# EAGLE design f1042-2 (EAGLE 7.6.0)
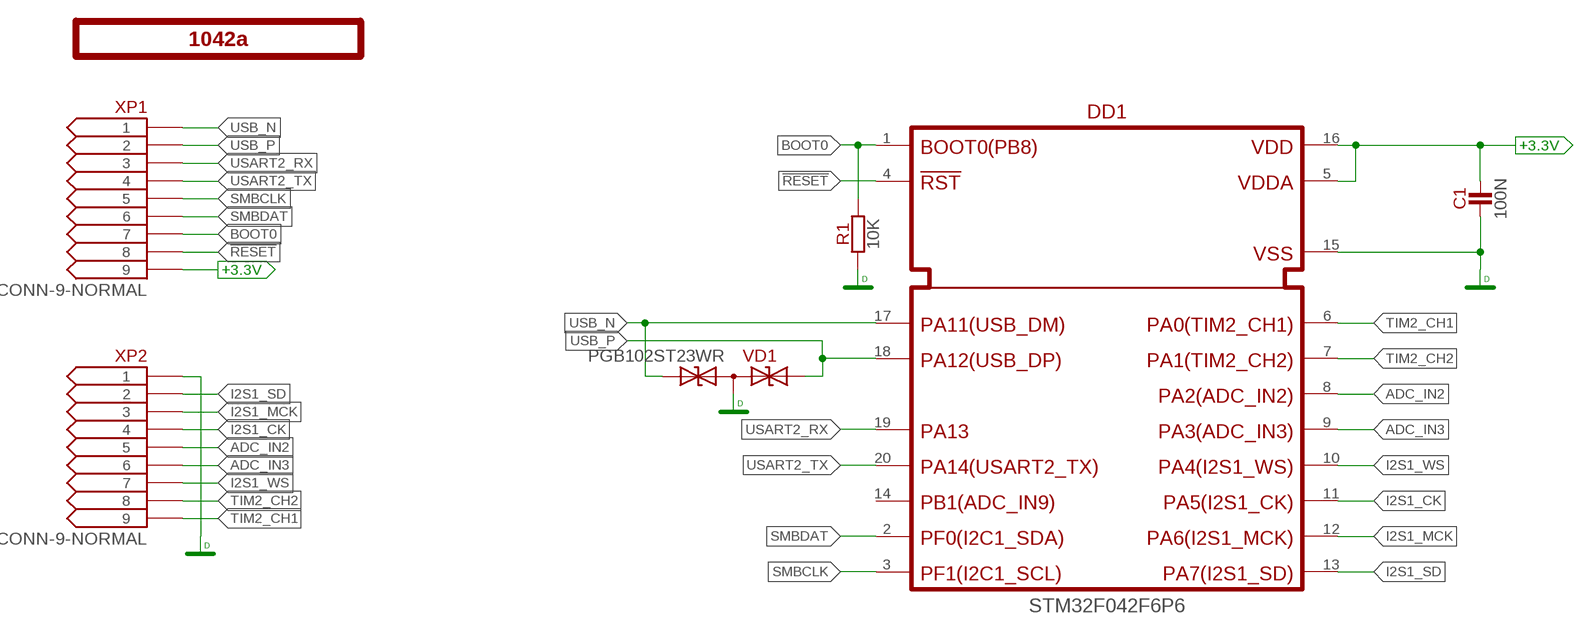
[diagram p0: schematic, sheet 1]

## Parts
C1  100N  [C-0805]
DD1  STM32F042F6P6  [TSSOP20]
PCB1  1042a  GENERIC-LOGO  [F-LOGO]
R1  10K  [R-0805]
VD1  PGB102ST23WR  [SOT23]
XP1  CONN-9-NORMAL  [MA03-9]
XP2  CONN-9-NORMAL  [MA03-9]

## Nets
!RESET: DD1.4(!RST) XP1.8
+3.3V: C1.2 DD1.5(VDDA) DD1.16(VDD) XP1.9
ADC_IN2: DD1.8(PA2) XP2.5
ADC_IN3: DD1.9(PA3) XP2.6
BOOT0: DD1.1(BOOT0) R1.2 XP1.7
DGND: C1.1 DD1.15(VSS) R1.1 VD1.3(C) XP2.1
I2S1_CK: DD1.11(PA5) XP2.4
I2S1_MCK: DD1.12(PA6) XP2.3
I2S1_SD: DD1.13(PA7) XP2.2
I2S1_WS: DD1.10(PA4) XP2.7
SMBCLK: DD1.3(PF1) XP1.5
SMBDAT: DD1.2(PF0) XP1.6
TIM2_CH1: DD1.6(PA0) XP2.9
TIM2_CH2: DD1.7(PA1) XP2.8
USART2_RX: DD1.19(PA13) XP1.3
USART2_TX: DD1.20(PA14) XP1.4
USB_N: DD1.17(PA11) VD1.2(A1) XP1.1
USB_P: DD1.18(PA12) VD1.1(A) XP1.2
Unconnected: DD1.14(PB1)

## Library data of the parts
C1 = capacitors:?; MOUSER: 77-VJ0805V104MXBPBC
DD1 = ic-stm:STM32F042F6P6; MOUSER: 511-STM32F042F6P6
PCB1 = module-footprints:GENERIC
R1 = resistors:?; MOUSER: 660-RK73H2ATTD1002F
VD1 = diodes-zener:PGB102ST23WR; MOUSER: 576-PGB102ST23WR
XP1 XP2 = connectors:CONN-9-?

## Board
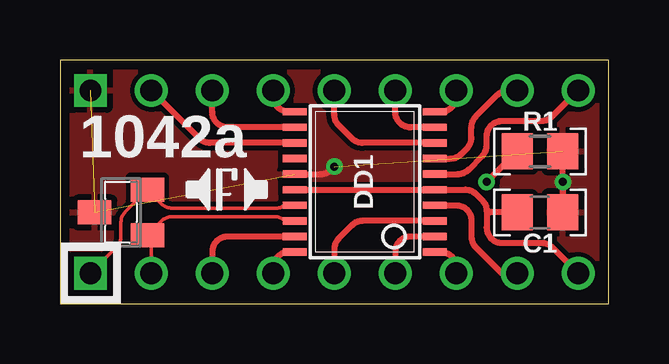
[diagram p1: board, top side]
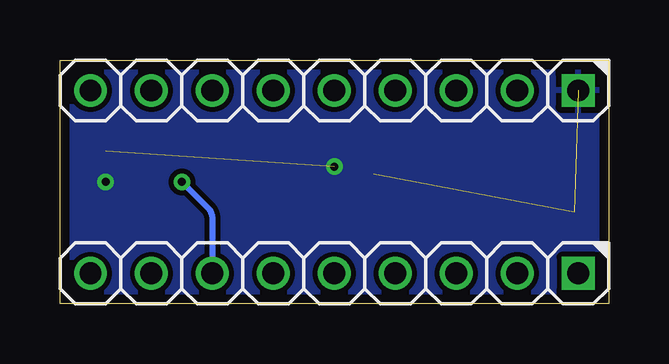
[diagram p2: board, bottom side, seen from below]

Size 22.86 x 10.16 mm. Coordinates in mm from the lower left corner, seen from the top.
Outline: 0,0 22.86,0 22.86,10.16 0,10.16 0,0
Copper layers (1*16): Top 0.0356mm / dielectric 1.5011mm / Bottom 0.0356mm
Design rules "sonictrain": minimum track width 6mil, minimum drill 13mil, track to track 8mil, track to pad 8mil, pad to pad 6mil, via to via 6mil, smd to smd 6mil, copper to edge 15mil, drill to drill 6mil, minimum pad ring 7mil, minimum via ring 7mil, stop-mask expansion 3mil, vias tented up to drill 25mil, thermal gap 10mil

### Footprints (pad centres in the part's own frame; a part is rotated, then mirrored left to right if it is on the bottom)
C-0805 = smd 1.3 x 1.5: 1 -0.95,0; 2 0.95,0
TSSOP20 = smd 0.305 x 0.991: 1 -2.925,-2.918; 2 -2.275,-2.918; 3 -1.625,-2.918; 4 -0.975,-2.918; 5 -0.325,-2.918; 6 0.325,-2.918; 7 0.975,-2.918; 8 1.625,-2.918; 9 2.275,-2.918; 10 2.925,-2.918; 11 2.925,2.918; 12 2.275,2.918; 13 1.625,2.918; 14 0.975,2.918; 15 0.325,2.918; 16 -0.325,2.918; 17 -0.975,2.918; 18 -1.625,2.918; 19 -2.275,2.918; 20 -2.925,2.918
R-0805 = smd 1.3 x 1.5: 1 -0.95,0; 2 0.95,0
SOT23 = smd 1 x 1.4: 1 -0.95,-1.1; 2 0.95,-1.1; 3 0,1.1
MA03-9 = drill 0.914 square: 1 0,0 | drill 0.914: 2 2.54,0; 3 5.08,0; 4 7.62,0; 5 10.16,0; 6 12.7,0; 7 15.24,0; 8 17.78,0; 9 20.32,0

### Placement (x,y rotation side)
C1  20,3.81 180 top
DD1  12.7,5.08 90 top
PCB1  6.98,5.08 0 top
R1  20,6.35 180 top
VD1  2.54,3.81 90 top
XP1  1.27,1.27 180 bottom
XP2  1.27,8.89 180 bottom

### Tracks (layer width: path | path; a pad name or v marks a point on that pad's centre or on a via)
!RESET
  Top 0.254: DD1.4 16.51,4.11 arc-90 17.14,3.47 17.14,2.8 arc45 17.33,2.35 18.41,1.27 XP1.8
+3.3V
  Top 0.254: 17.78,3.86 arc45 17.59,4.31 17.34,4.57 arc45 16.89,4.75 DD1.5 DD1.16 | 17.78,3.86 17.78,3.17 arc90 18.41,2.54 20.06,2.54 arc-45 20.51,2.35 XP1.9 | C1.2 17.91,3.81 arc-45 17.78,3.86
ADC_IN2
  Top 0.254: DD1.8 12.61,6.71 arc-45 12.16,6.89 11.62,7.43 arc-45 11.43,7.88 XP2.5
ADC_IN3
  Top 0.254: DD1.9 14.61,7.36 arc-90 13.97,7.99 XP2.6
BOOT0  (via drill 0.33)
  Top 0.254: DD1.1 15.88,2.15 arc-90 16.51,1.52 XP1.7 | v17.78,5.08 arc45 v17.78,5.08 R1.2
  Bottom 0.254: v17.78,5.08 16.7,4 arc45 16.51,3.55 XP1.7
DGND  (via drill 0.33)  (3 unrouted)
  Top 0.254: DD1.15 10.86,5.41 arc45 11.31,5.59 v11.43,5.71 | R1.1 arc-45 R1.1 v20.95,5.08 C1.1 arc-45 C1.1
  pour Bottom: 0,10.16 22.86,10.16 22.86,0 0,0
  pour Top: 0,10.16 0,0 22.86,0 22.86,10.16
I2S1_CK
  Top 0.254: DD1.11 9.52,8.01 arc-90 8.89,8.64 XP2.4
I2S1_MCK
  Top 0.254: DD1.12 6.98,7.36 arc-90 6.35,7.99 XP2.3
I2S1_SD
  Top 0.254: DD1.13 6.26,6.71 arc-45 5.81,6.89 XP2.2
I2S1_WS
  Top 0.254: DD1.10 15.88,8.01 arc90 16.51,8.64 XP2.7
SMBCLK
  Top 0.254: DD1.3 12.61,3.46 arc45 12.16,3.27 11.62,2.73 arc45 11.43,2.28 XP1.5
SMBDAT
  Top 0.254: DD1.2 14.61,2.81 arc90 13.97,2.17 XP1.6
TIM2_CH1
  Top 0.254: DD1.6 16.57,5.41 arc45 17.02,5.59 17.59,6.16 arc45 17.78,6.61 17.78,6.99 arc-90 18.41,7.62 20.06,7.62 arc45 20.51,7.81 XP2.9
TIM2_CH2
  Top 0.254: DD1.7 16.27,6.05 arc45 16.72,6.24 16.96,6.48 arc45 17.14,6.93 17.14,7.36 arc-45 17.33,7.81 18.23,8.7 arc-45 18.68,8.89 XP2.8
USART2_RX
  Top 0.254: DD1.19 6.98,2.81 arc90 6.35,2.17 XP1.3
USART2_TX
  Top 0.254: DD1.20 9.52,2.15 arc90 8.89,1.52 XP1.4
USB_N
  Top 0.152: DD1.17 9.32,4.11 arc-45 9.04,3.99 4.68,3.99 arc-45 4.23,4.17 VD1.2 2.73,3.85 arc45 2.54,3.4 2.54,2.8 arc-45 2.35,2.35 XP1.1
USB_P
  Top 0.152: DD1.18 9.39,3.46 arc45 8.96,3.63 4.68,3.63 arc45 4.23,3.45 VD1.1 3.81,2.69 XP1.2